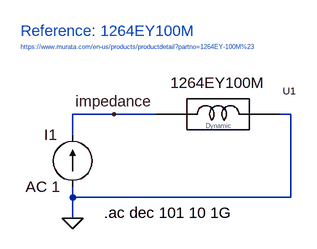
[diagram p0: schematic 05-1264EY100M_murata_encrypted_model.asc]
05-1264EY100M_murata_encrypted_model.asc, the LTspice schematic file:
Version 4
SHEET 1 880 680
WIRE 144 112 80 112
WIRE 208 112 144 112
WIRE 416 112 400 112
WIRE 80 144 80 112
WIRE 80 240 80 224
WIRE 416 240 416 112
WIRE 416 240 80 240
WIRE 80 272 80 240
FLAG 80 272 0
FLAG 144 112 impedance
SYMBOL current 80 224 R180
WINDOW 0 24 80 Left 2
WINDOW 3 24 0 Left 2
WINDOW 123 19 0 Left 2
WINDOW 39 0 0 Left 0
SYMATTR InstName I1
SYMATTR Value ""
SYMATTR Value2 AC 1
SYMBOL 1264EY100M_LT 304 112 R0
SYMATTR InstName U1
TEXT 128 264 Left 2 !.ac dec 101 10 1G
TEXT 0 -16 Left 2 ;Reference: 1264EY100M
TEXT 0 8 Left 0 ;https://www.murata.com/en-us/products/productdetail?partno=1264EY-100M%23

The netlist it stands for:
* 05-1264EY100M_murata_encrypted_model.asc
I1 0 impedance AC 1
XU1 impedance 0 1264EY100M  ; pins port1 port2
.ac dec 101 10 1G
* Reference: 1264EY100M
* https://www.murata.com/en-us/products/productdetail?partno=1264EY-100M%23
.lib 1264EY100M_LT.mod
.backanno
.end

* Results of the author's LTspice run, read from the files saved beside the schematic
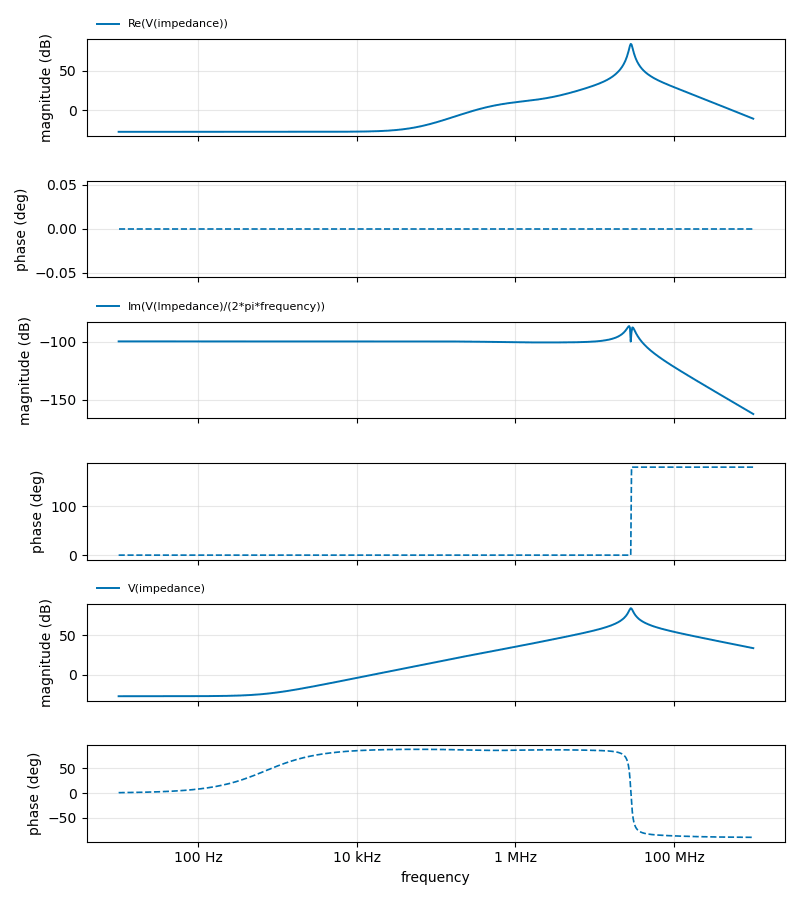
[diagram p1: AC Analysis of 05-1264EY100M_murata_encrypted_model.asc, plotted from the saved traces]
* AC Analysis, 1 run:
*   Re(V(impedance)): -26.94 dB at 10 Hz, -10.39 dB at 1 GHz, peak 83.82 dB at 28.54 MHz, 3 dB below the peak at 27.78 MHz and 29.63 MHz
*   Im(V(Impedance)/(2*pi*frequency)): -99.90 dB at 10 Hz, -162.39 dB at 1 GHz, peak -86.69 dB at 27.27 MHz, 3 dB below the peak at 25.1 MHz and 27.98 MHz
*   V(impedance): -26.94 dB at 10 Hz, 33.57 dB at 1 GHz, peak 83.88 dB at 28.54 MHz, 3 dB below the peak at 27.27 MHz and 30.18 MHz